# EAGLE design ContactlessCon (EAGLE 9.6.2)
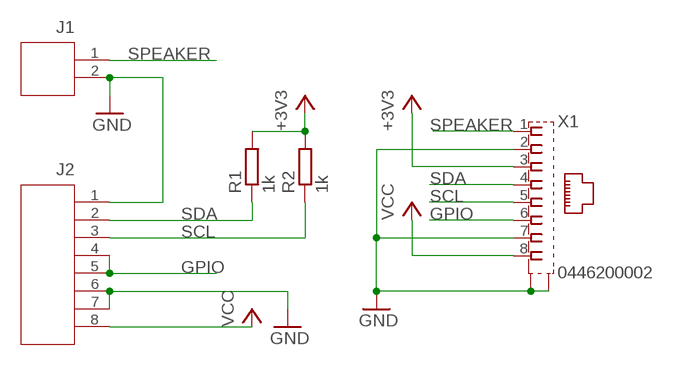
[diagram p0: schematic, sheet 1]

## Parts
J1  PINHEADER-212*1  [PINHEADER-2*1]
J2  PINHEADER-818*1  [PINHEADER-8*1]
R1  1k  R-EU_R1206  [R1206]
R2  1k  R-EU_R1206  [R1206]
X1  0446200002  [0446200002]

## Nets
+3V3: R1.2 R2.2 X1.3
GND: J1.2 J2.1 J2.6 J2.7 X1.2 X1.7 X1.S@1(S1) X1.S@2(S2)
GPIO: J2.4 J2.5 X1.6
SCL: J2.3 R2.1 X1.5
SDA: J2.2 R1.1 X1.4
SPEAKER: J1.1 X1.1
VCC: J2.8 X1.8

## Library data of the parts
J1 = PINHEADER:PINHEADER-2*1
J2 = PINHEADER:PINHEADER-8*1
R1 R2 = rcl:R-EU_: RESISTOR, European symbol; SPICEPREFIX: R
X1 = con-molex:0446200002: RJ-45 INVERTED MODULAR JACK ASSEMBLY WITH RJ-11 KEEPOUT FEATURE Source: Data sheet <http://www.farnell.com/datasheets/73207.pdf> MOLEX 0446200002 BUCHSE, RJ45, GESCHIRMT Source: Farnell <http://de.farnell.com/molex/0446200002/buchse-rj45-geschirmt/dp/9251910?ost=9251910>; MF: MOLEX; MPN: 0446200002; OC_FARNELL: 9251910

## Board
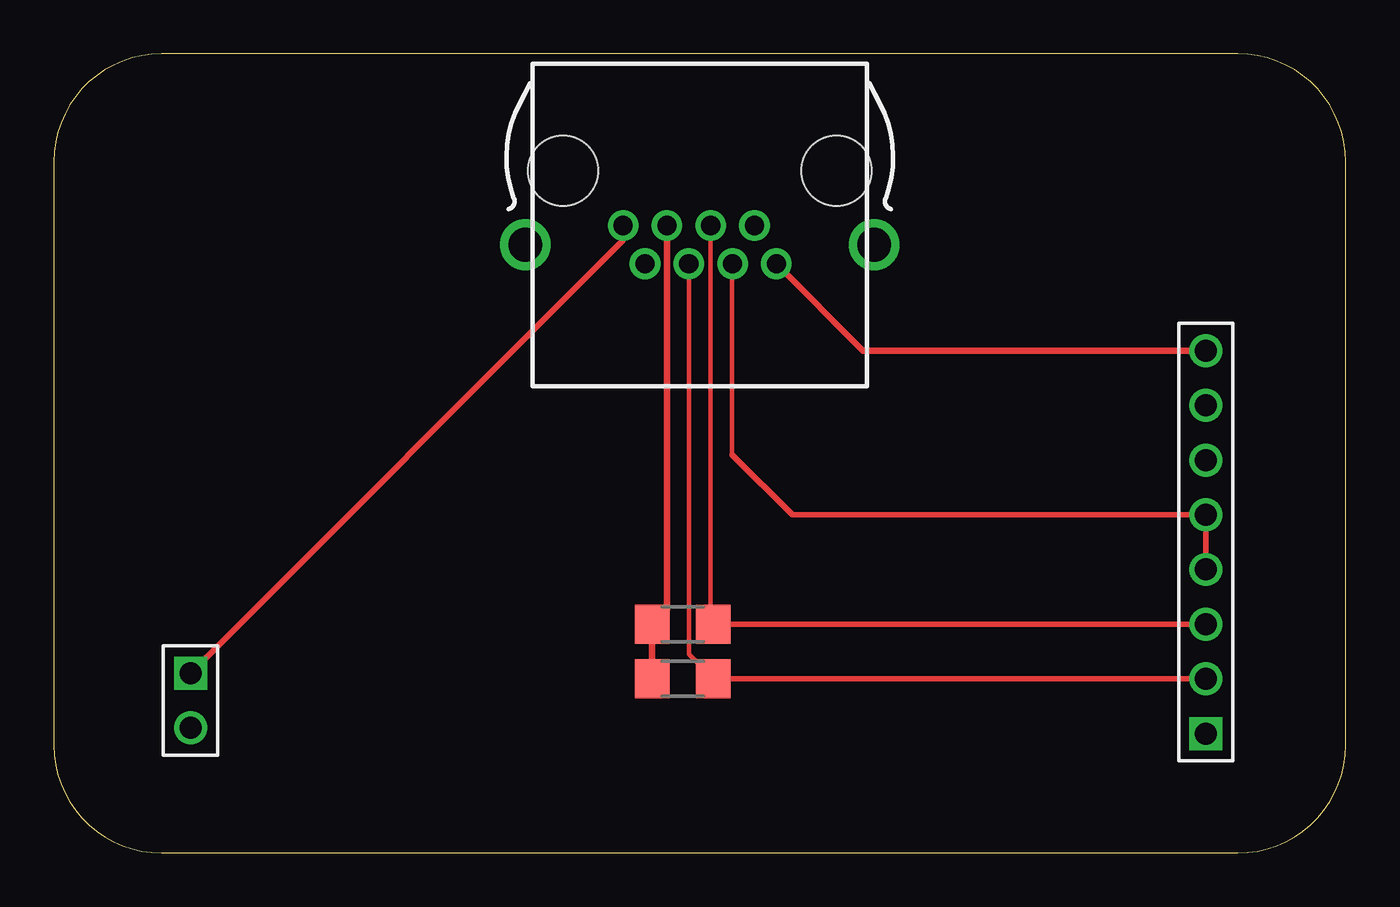
[diagram p1: board, top side]
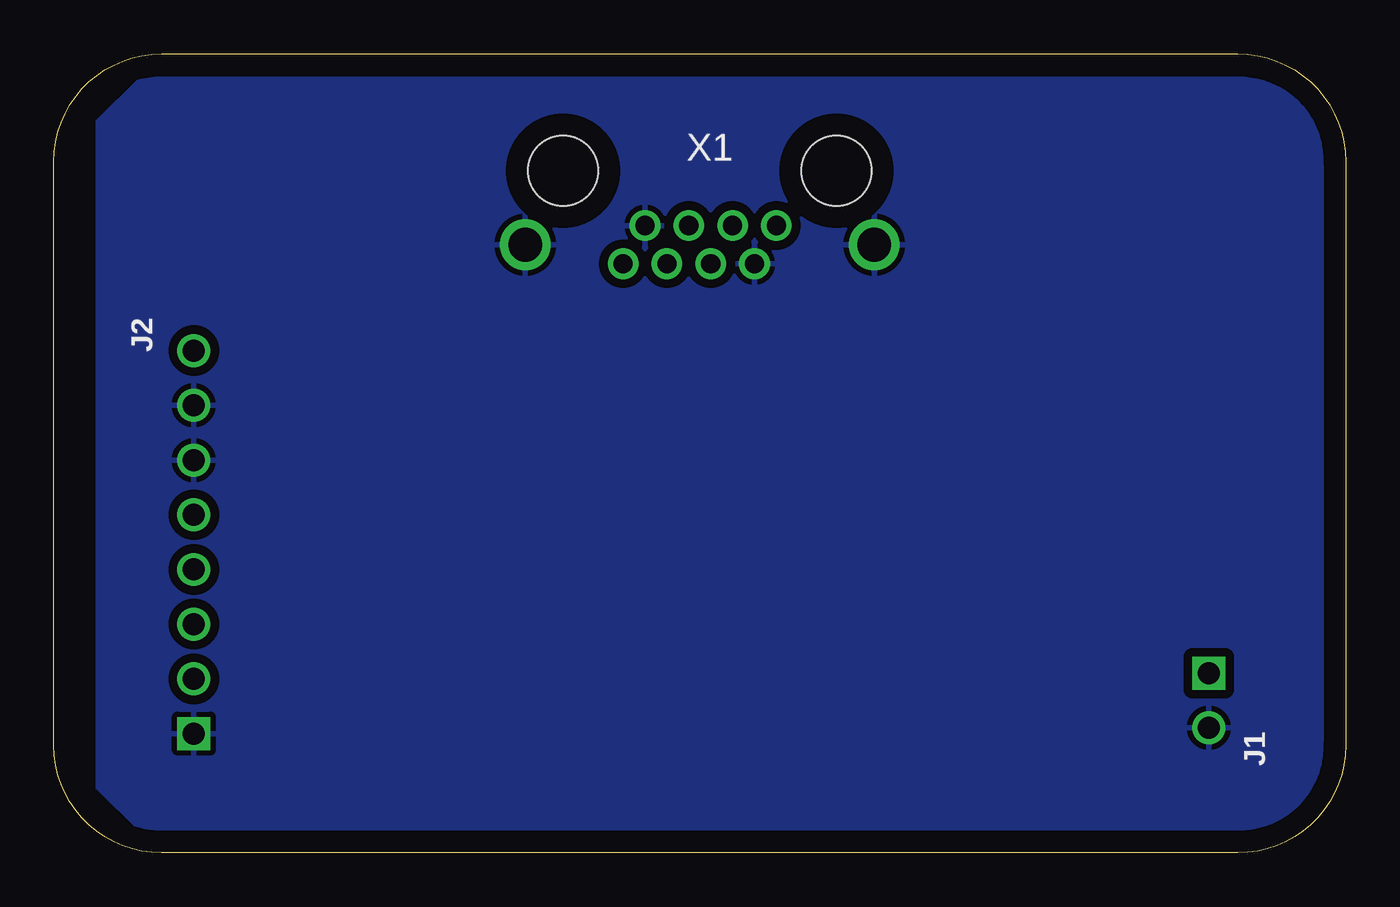
[diagram p2: board, bottom side, seen from below]

Size 60 x 37.1 mm. Coordinates in mm from the lower left corner, seen from the top.
Outline: 0,32.1 0,5 arc90 5,0 55,0 arc90 60,5 60,32.1 arc90 55,37.1 5,37.1 arc90 0,32.1
Copper layers (1*16): Top 0.035mm / dielectric 1.5mm / Bottom 0.035mm
Design rules "default": minimum track width 6mil, minimum drill 0.35mm, track to track 6mil, track to pad 6mil, pad to pad 6mil, via to via 6mil, smd to smd 6mil, copper to edge 40mil, drill to drill 6mil, minimum pad ring 10mil, minimum via ring 8mil, stop-mask expansion 4mil, vias tented up to drill 0mil, thermal gap 10mil

### Footprints (pad centres in the part's own frame; a part is rotated, then mirrored left to right if it is on the bottom)
PINHEADER-2*1 = drill 1.02 square: 1 -1.27,0 | drill 1.02: 2 1.27,0
PINHEADER-8*1 = drill 1.02 square: 1 -6.35,0 | drill 1.02: 2 -3.81,0; 3 -1.27,0; 4 1.27,0; 5 3.81,0; 6 6.35,0; 7 8.89,0; 8 11.43,0
R1206 = smd 1.6 x 1.803: 1 -1.422,0; 2 1.422,0
0446200002 = drill 0.889 pad 1.422: 1 3.556,2.54; 2 2.54,4.318; 3 1.524,2.54; 4 0.508,4.318; 5 -0.508,2.54; 6 -1.524,4.318; 7 -2.54,2.54; 8 -3.556,4.318 | drill 1.575 pad 2.286: S@1 -8.103,3.429; S@2 8.103,3.429 | hole 3.251: 6.35,0; -6.35,0

### Placement (x,y rotation side)
J1  6.35,7.08 270 top
J2  53.5,11.89 90 top
R1  29.21,8.08 180 top
R2  29.21,10.62 180 top
X1  30,31.67 180 top

### Tracks (layer width: path | path; a pad name or v marks a point on that pad's centre or on a via)
+3V3
  Top 0.305: R1.2 R2.2 28.48,11.31 X1.3
GND
  pour Bottom (isolate 0.406): 3,36 56,36 58,34 58,3 56,1 3,1 1,3 1,34
GPIO
  Top 0.203: 31.51,18.49 31.51,27.34 X1.6
  Top 0.254: J2.4 J2.5 34.3,15.7 31.51,18.49
SCL
  Top 0.203: R2.1 30.51,10.74 X1.5
  Top 0.254: J2.3 R2.1 30,10.62
SDA
  Top 0.203: X1.4 29.49,9.22 R1.1
  Top 0.254: J2.2 R1.1
SPEAKER
  Top 0.254: J1.1 26.44,28.44 X1.1
VCC
  Top 0.305: X1.8 37.59,23.32 J2.8